# EAGLE design Grove PIR Sensor v1.2 (EAGLE 6.4)
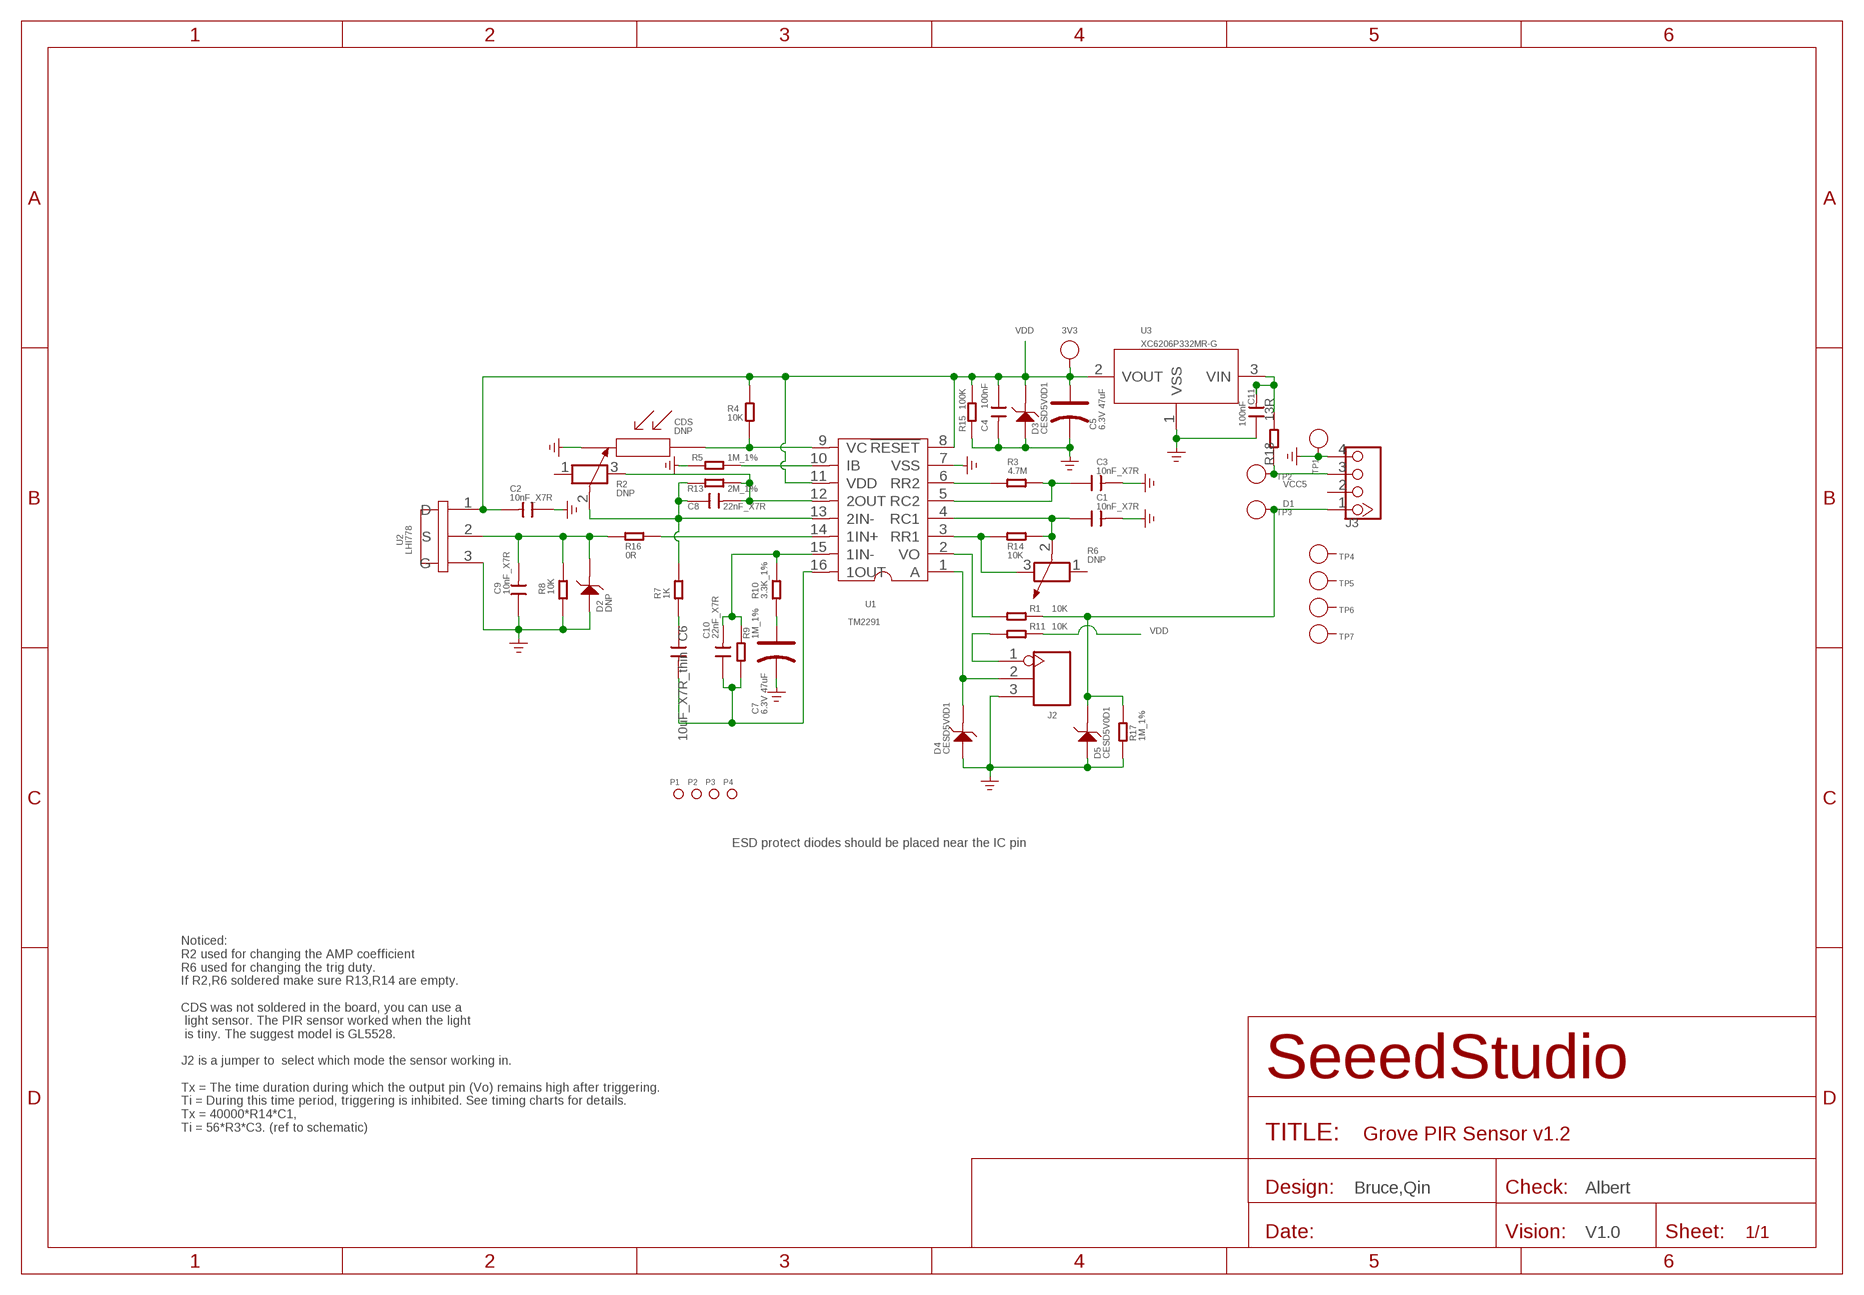
[diagram p0: schematic, sheet 1]

## Parts
3V3  PAD-TEST-POINT'3535'  [TP_3535]
C1  10nF_X7R  C-0603  [C0603]
C2  10nF_X7R  C-0603  [C0603]
C3  10nF_X7R  C-0603  [C0603]
C4  100nF  C-0603  [C0603]
C5  6.3V 47uF  CAP-AVX-A  [AVX-A]
C6  10uF_X7R_thin  C-0805  [C0805]
C7  6.3V 47uF  CAP-AVX-A  [AVX-A]
C8  22nF_X7R  C-0603  [C0603]
C9  10nF_X7R  C-0603  [C0603]
C10  22nF_X7R  C-0603  [C0603]
C11  100nF  C-0603  [C0603]
CDS  DNP  CDS  [CDS]
D2  DNP  D-ESD-2P'CESD5V0D1'  [SOD123-2.7X1.6]
D3  CESD5V0D1  D-ESD-2P'CESD5V0D1'  [SOD123-2.7X1.6]
D4  CESD5V0D1  D-ESD-2P'CESD5V0D1'  [SOD123-2.7X1.6]
D5  CESD5V0D1  D-ESD-2P'CESD5V0D1'  [SOD123-2.7X1.6]
J2  HEADER-3P-2.54  [3P-2.54]
J3  TWIG-4P-2.0-2.0  [4P-2.0]
P1  PAD-MARK  [ROUND-MARK-1.0]
P2  PAD-MARK  [ROUND-MARK-1.0]
P3  PAD-MARK  [ROUND-MARK-1.0]
P4  PAD-MARK  [ROUND-MARK-1.0]
R1  10K  R-0603  [R0603]
R2  DNP  R-POTENTIOMETER-SMD  [3P-SMD-SQUA-3.6X3.3]
R3  4.7M  R-0603  [R0603]
R4  10K  R-0603  [R0603]
R5  1M_1%  R-0603  [R0603]
R6  DNP  R-POTENTIOMETER-SMD  [3P-SMD-SQUA-3.6X3.3]
R7  1K  R-0603  [R0603]
R8  10K  R-0603  [R0603]
R9  1M_1%  R-0603  [R0603]
R10  3.3K_1%  R-0603  [R0603]
R11  10K  R-0603  [R0603]
R13  2M_1%  R-0603  [R0603]
R14  10K  R-0603  [R0603]
R15  100K  R-0603  [R0603]
R16  0R  R-0603  [R0603]
R17  1M_1%  R-0603  [R0603]
R18  13R  R-1206  [R1206]
TP1  PAD-TEST-POINT'3535'  [TP_3535]
TP2  PAD-TEST-POINT'3535'  [TP_3535]
TP3  PAD-TEST-POINT'3535'  [TP_3535]
TP4  PAD-TEST-POINT'3535'  [TP_3535]
TP5  PAD-TEST-POINT'3535'  [TP_3535]
TP6  PAD-TEST-POINT'3535'  [TP_3535]
TP7  PAD-TEST-POINT'3535'  [TP_3535]
U1  TM2291  [SOP16]
U2  LHI778  [3P-D8.1MM]
U3  XC6206P332MR-G  XC6206MR  [SOT23]

## Nets
D1: D5.2 J3.1 R1.1 R17.2 TP3.T
GND: C1.2 C2.1 C3.2 C4.2 C5.- C7.- C9.1 C11.1 CDS.1 D2.1 D3.1 D4.1 D5.1 J2.3 J3.4 R5.1 R8.1 R15.2 R17.1 TP1.T U1.7(VSS) U2.3(G) U3.1(VSS)
N$1: R6.3 R14.1 U1.3(RR1)
N$2: C1.1 R6.2 R14.2 U1.4(RC1)
N$4: J2.1 R11.2
N$5: R1.2 U1.2(VO)
N$6: R3.2 U1.6(RR2)
N$7: C3.1 R3.1 U1.5(RC2)
N$8: CDS.2 R4.2 U1.9(VC)
N$9: R5.2 U1.10(IB)
N$10: C9.2 D2.2 R8.2 R16.2 U2.2(S)
N$11: C8.2 R2.3 R13.1 U1.12(2OUT)
N$12: C8.1 R2.2 R7.2 R13.2 U1.13(2IN-)
N$13: C6.2 C10.1 R9.1 U1.16(1OUT)
N$14: C10.2 R9.2 R10.2 U1.15(1IN-)
N$15: C6.1 R7.1
N$16: D4.2 J2.2 U1.1(A)
N$17: C7.+ R10.1
N$19: R16.1 U1.14(1IN+)
N$20: C11.2 R18.2 U3.3(VIN)
VCC5: J3.3 R18.1 TP2.T
VDD: 3V3.T C2.2 C4.1 C5.+ D3.2 R4.1 R11.1 R15.1 U1.8(!RESET) U1.11(VDD) U2.1(D) U3.2(VOUT)
Unconnected: J3.2 R2.1 R6.1 TP4.T TP5.T TP6.T TP7.T

## Notes on the sheet
- ESD protect diodes should be placed near the IC pin
- Noticed:
  R2 used for changing the AMP coefficient
  R6 used for changing the trig duty.
  If R2,R6 soldered make sure R13,R14 are empty.
  
  CDS was not soldered in the board, you can use a
   light sensor. The PIR sensor worked when the light
   is tiny. The suggest model is GL5528.
  
  J2 is a jumper to  select which mode the sensor working in.
  
  Tx = The time duration during which the output pin (Vo) remains high after triggering.
  Ti = During this time period, triggering is inhibited. See timing charts for details.
  Tx = 40000*R14*C1,
  Ti = 56*R3*C3. (ref to schematic)
- Bruce,Qin | Albert
- V1.0

## Library data of the parts
3V3 TP1-TP7 = Discrete:PAD-TEST-POINT; PARTNO: DNP
C1-C4 C6 C8-C11 = Discrete:C*: Ceramic Capacitors
C5 C7 = Discrete:CAP*: Electrolytic Capacitors,Tantalum Capacitors and Super Capacitors
CDS = seeedleo:CDS
D2-D5 = Discrete:D-ESD-2P: Diodes for Protectiong against ESD
J2 = Connector:HEADER-3P
J3 = Connector :TWIG-4P-2.0
P1-P4 = Discrete:PAD-MARK; PARTNO: DNP
R1 R3-R5 R7-R11 R13-R18 = Discrete:R*
R2 R6 = Discrete:R-POTENTIOMETER*: Potentiometer
U1 = PIR_motion_sensor:TM2291: Infrared signal processor
U2 = PIR_motion_sensor:LHI778: Pyroelectric Infrared Detectors
U3 = IC:XC6206: LOW ESR Cap.Compatible Positive Voltage Regulators

## Board
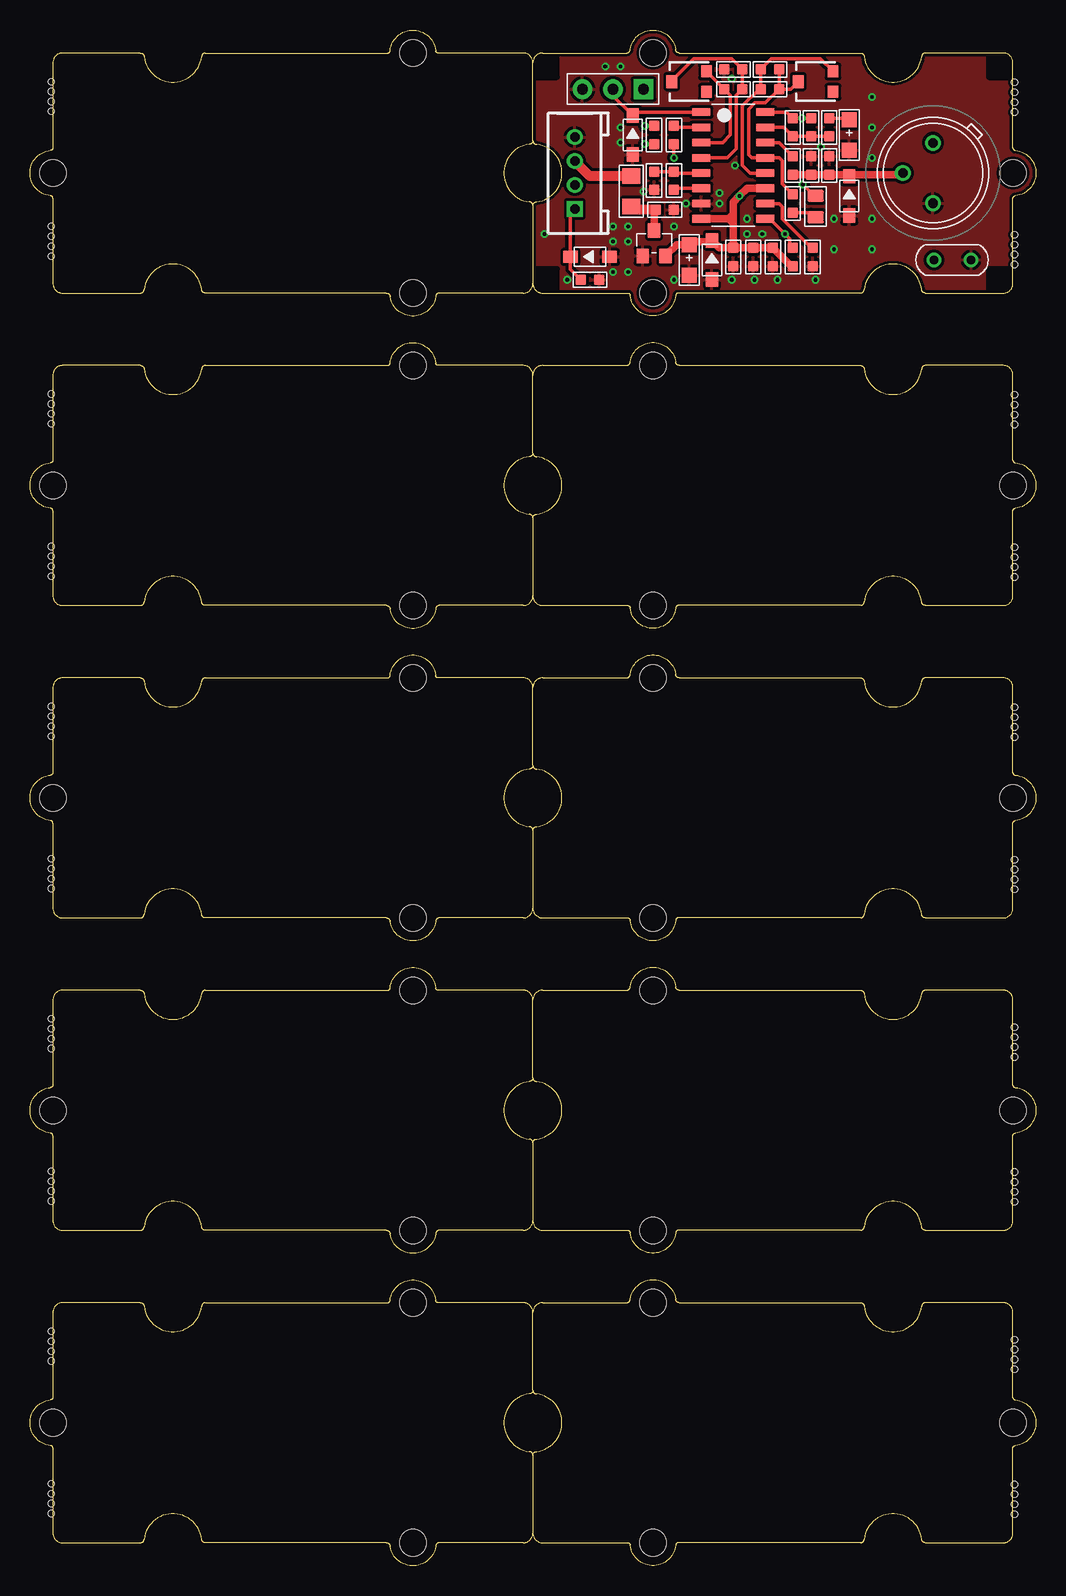
[diagram p1: board, top side]
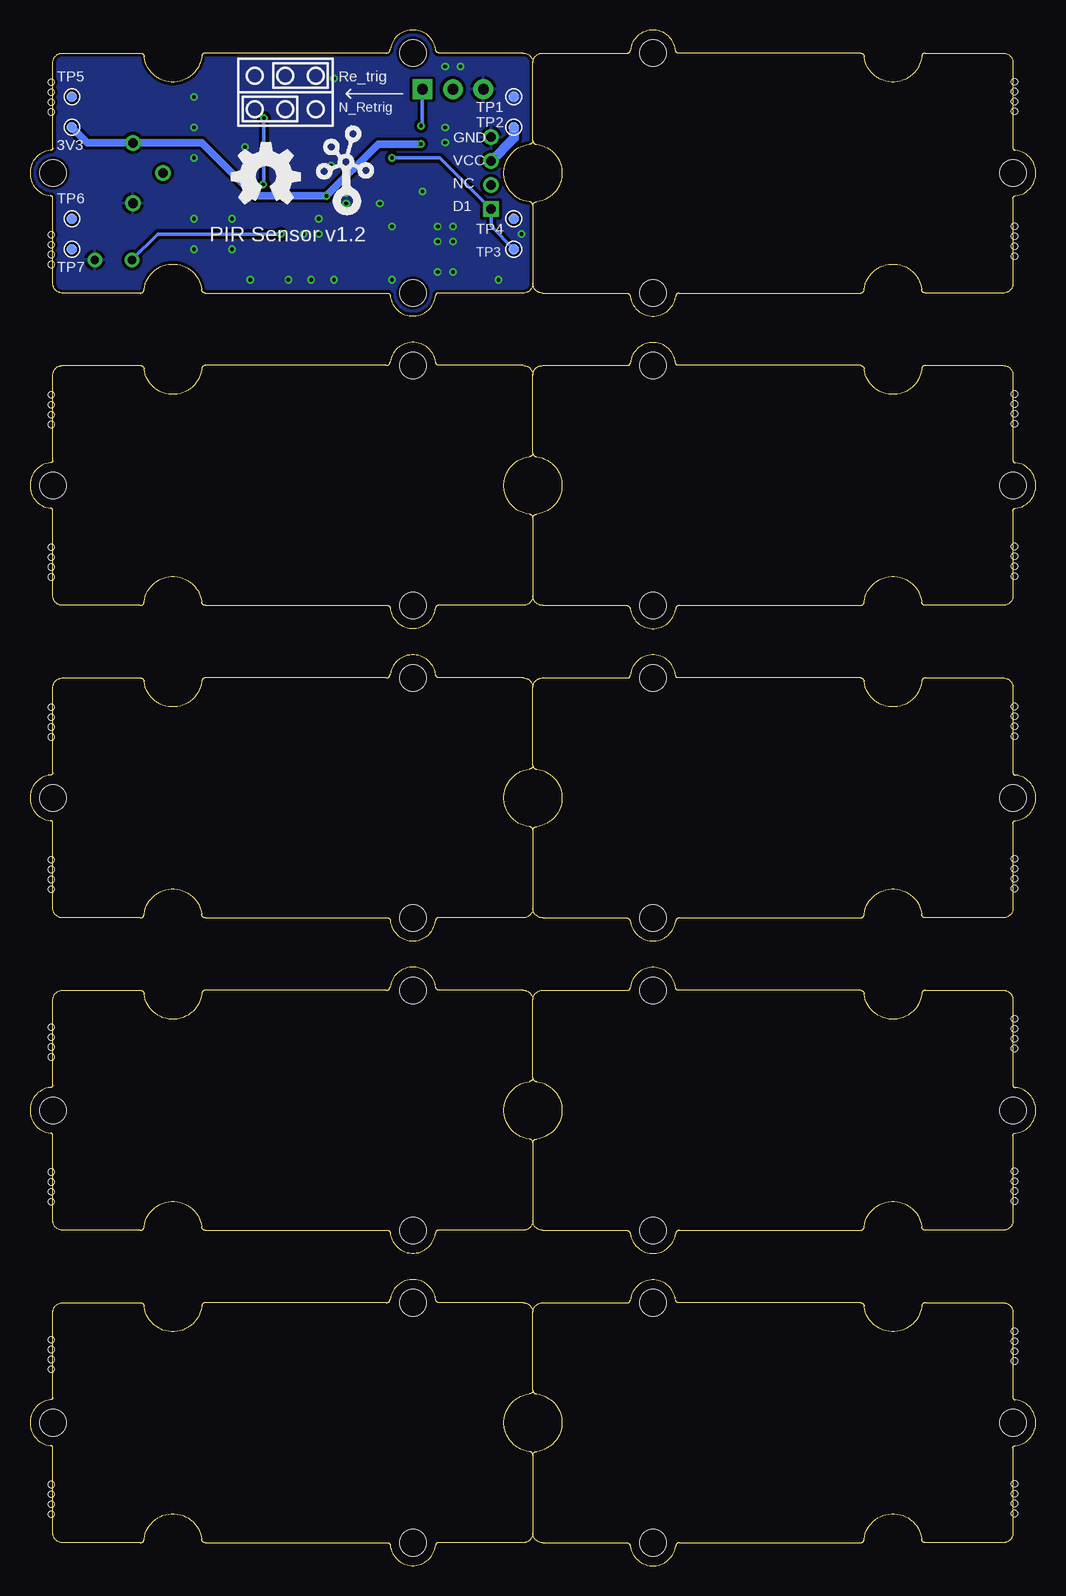
[diagram p2: board, bottom side, seen from below]

Size 83.82 x 127.98 mm. Coordinates in mm from the lower left corner, seen from the top.
Copper layers (1*16): Top 0.035mm / dielectric 1.5mm / Bottom 0.035mm
Design rules "default *": minimum track width 6mil, minimum drill 12mil, track to track 6mil, track to pad 6mil, pad to pad 6mil, via to via 6mil, smd to smd 0mil, copper to edge 10mil, drill to drill 10mil, minimum pad ring 10mil, minimum via ring 6mil, stop-mask expansion 2mil, vias tented up to drill 100mil, thermal gap 10mil
Holes 0.5 mm at 1.78,32.88 1.78,30.4 1.78,31.23 1.78,32.05 1.78,45.58 1.78,43.1 1.78,43.93 1.78,44.75 1.78,58.91 1.78,56.43 1.78,57.26 1.78,58.09 1.78,71.61 1.78,69.13 1.78,69.96 1.78,70.79 1.78,84.95 1.78,82.47 1.78,83.3 1.78,84.12 1.78,97.65 1.78,95.17 1.78,96 1.78,96.82 1.78,111.62 1.78,109.14 1.78,109.97 1.78,110.79 1.78,123.68 1.78,121.2 1.78,122.03 1.78,122.86 82.04,121.14 82.04,123.62 82.04,122.79 82.04,121.97 82.04,108.44 82.04,110.92 82.04,110.09 82.04,109.27 82.04,95.11 82.04,97.58 82.04,96.76 82.04,95.93 82.04,82.41 82.04,84.88 82.04,84.06 82.04,83.23 82.04,69.07 82.04,71.55 82.04,70.72 82.04,69.9 82.04,56.37 82.04,58.85 82.04,58.02 82.04,57.2 82.04,42.4 82.04,44.88 82.04,44.05 82.04,43.23 82.04,30.34 82.04,32.81 82.04,31.99 82.04,31.16 1.78,6.84 1.78,4.36 1.78,5.19 1.78,6.02 1.78,19.54 1.78,17.06 1.78,17.89 1.78,18.72 82.04,16.37 82.04,18.84 82.04,18.02 82.04,17.19 82.04,4.3 82.04,6.78 82.04,5.95 82.04,5.13
Holes 1.91 mm at -4.13,2.4 87.95,2.4 87.95,125.59 -4.13,125.59

### Footprints (pad centres in the part's own frame; a part is rotated, then mirrored left to right if it is on the bottom)
TP_3535 = smd 0.889 x 0.889: T 0,0
C0603 = smd 0.889 x 0.889: 1 -0.762,0; 2 0.762,0
AVX-A = smd 1.27 x 1.27: + -1.27,0; - 1.27,0
C0805 = smd 1.016 x 1.397: 1 -0.889,0; 2 0.889,0
CDS = drill 0.7: 1 0,0; 2 3.1,0
SOD123-2.7X1.6 = smd 1.2 x 1.02: 1 -1.635,0; 2 1.635,0
3P-2.54 = drill 0.889 pad 1.651 square: 1 0,2.54 | drill 0.889 pad 1.651: 2 0,0; 3 0,-2.54
4P-2.0 = drill 0.8 pad 1.27 square: 1 -3,0 | drill 0.8 pad 1.27: 2 -1,0; 3 1,0; 4 3,0
ROUND-MARK-1.0 = smd 1.016 x 1.016: P$1 0,0
R0603 = smd 0.889 x 0.889: 1 -0.762,0; 2 0.762,0
3P-SMD-SQUA-3.6X3.3 = smd 1 x 0.9: 1 -0.85,-1.45; 3 0.85,-1.45 | smd 1.1 x 0.9: 2 0,1.45
R1206 = smd 1.27 x 1.524: 1 -1.27,0; 2 1.27,0
SOP16 = smd 0.635 x 1.524: 1 0,0; 2 1.27,0; 3 2.54,0; 4 3.81,0; 5 5.08,0; 6 6.35,0; 7 7.62,0; 8 8.89,0; 9 8.89,5.334; 10 7.62,5.334; 11 6.35,5.334; 12 5.08,5.334; 13 3.81,5.334; 14 2.54,5.334; 15 1.27,5.334; 16 0,5.334
3P-D8.1MM = drill 0.8: 1 1.778,1.778; 2 -1.778,1.778; 3 -1.778,-1.778
SOT23 = smd 1.016 x 1.2: 1 -0.95,-1.06; 2 0.95,-1.06; 3 0,1.06
GROVE-2CONNECTOR = hole 2.2: -10,-10; -10,10; 20,0

### Placement (x,y rotation side)
3V3  80.33,119.87 0 bottom
C1  58.61,124.7 180 top
C2  61.91,109.08 90 top
C3  52.01,115.43 270 top
C4  58.61,109.08 270 top
C5  54.93,108.82 270 top
C6  65.47,113.27 90 top
C7  68.26,119.24 270 top
C8  61.66,123.05 180 top
C9  66.61,116.7 270 top
C10  63.56,119.87 270 top
C11  52.9,113.01 180 top
CDS  78.42,108.82 180 top
D2  68.26,114.16 90 top
D3  56.83,108.82 90 top
D4  50.23,119.24 90 top
D5  46.67,109.08 180 top
J2  48.58,123.05 270 top
J3  45.4,116.06 90 top
P1  -4.13,7.48 0 top  (outside the outline)
P2  87.95,7.48 0 top  (outside the outline)
P3  -4.13,120.51 0 top  (outside the outline)
P4  87.95,120.51 0 top  (outside the outline)
R1  53.66,119.24 90 top
R2  65.47,123.68 90 top
R3  53.66,115.43 270 top
R4  63.56,109.08 90 top
R5  65.22,109.08 90 top
R6  54.93,123.68 90 top
R7  63.56,113.52 90 top
R8  65.09,116.7 270 top
R9  65.09,119.87 270 top
R10  66.61,119.87 270 top
R11  52.01,119.24 90 top
R13  61.66,124.7 0 top
R14  58.61,123.05 0 top
R15  60.26,109.08 270 top
R16  63.56,116.7 270 top
R17  46.67,107.17 180 top
R18  50.1,114.54 270 top
TP1  43.5,122.41 0 bottom
TP2  43.5,119.87 0 bottom
TP3  43.5,109.71 0 bottom
TP4  43.5,112.25 0 bottom
TP5  80.33,122.41 0 bottom
TP6  80.33,112.25 0 bottom
TP7  80.33,109.71 0 bottom
U1  55.94,121.14 270 top
U2  75.25,116.06 45 top
U3  52.01,110.22 0 top
U$3  [GROVE-2CONNECTOR]  21.91,116.06 180 top
U$16  [OSHW_FILLX200_NOTEXT]  66.99,113.52 0 bottom
U$17  [GROVE-2CONNECTOR]  61.91,116.06 0 top
U$18  [GROVE-2CONNECTOR]  21.91,90.03 180 top
U$19  [GROVE-2CONNECTOR]  61.91,90.03 0 top
U$20  [GROVE-2CONNECTOR]  21.91,63.99 180 top
U$21  [GROVE-2CONNECTOR]  61.91,63.99 0 top
U$22  [GROVE-2CONNECTOR]  21.91,37.96 180 top
U$23  [GROVE-2CONNECTOR]  61.91,37.96 0 top
U$24  [GROVE-2CONNECTOR]  21.91,11.92 180 top
U$25  [GROVE-2CONNECTOR]  61.91,11.92 0 top
U$26  [TWIGLOGO]  57.47,113.52 0 bottom

### Tracks (layer width: path | path; a pad name or v marks a point on that pad's centre or on a via)
D1  (via drill 0.3 pad 0.64)
  Top 0.305: J3.1 45.04,112.7 D5.2 45.04,108.04 R17.2 | R1.1 v53.66,117.33
  Bottom 0.305: v53.66,117.33 49.67,117.33 J3.1 45.4,111.62 TP3.T
GND  (via drill 0.3 pad 0.64)
  other vias: 58.48,107.17 60.39,107.17 62.29,107.17 65.47,107.17 66.99,112.25 70.17,112.25 59.75,110.98 61.02,110.98 59.75,112.25 57.47,113.52 66.99,109.71 70.17,109.71 57.47,114.41 58.74,116.7 58.48,123.94 49.21,124.95 54.67,113.52 53.66,111.62 53.66,107.17 48.58,110.35 49.85,110.35 49.85,107.81 48.58,107.81 49.21,119.87 49.21,118.6 51.12,114.54 70.17,117.33 70.17,119.87 65.91,118.22 42.86,110.98 44.77,107.17 70.17,122.41 49.85,111.62 48.58,111.62 47.94,124.95
  pour Top (isolate 0.254): 41.59,104 84.14,104 84.14,128.13 41.59,128.13
  pour Bottom (isolate 0.254): 41.59,104 84.14,104 84.14,128.13 41.59,128.13
N$1
  Top 0.305: R6.3 | U1.3 57.72,118.6 58.36,119.24 58.36,122.54 R14.1 R6.3 | 56.24,124.53 R6.3
N$2
  Top 0.305: R6.2 53.48,123.76 55.31,125.59 58.48,125.59 C1.1 R14.2 58.87,122.54 58.87,118.09 58.1,117.33 U1.4
N$4  (via drill 0.3 pad 0.64)
  Top 0.305: R11.2 v51.25,120
  Bottom 0.305: J2.1 51.12,120.13 v51.25,120
N$5
  Top 0.305: U1.2 53.79,119.87 R1.2
N$6
  Top 0.305: U1.6 53.79,114.79 R3.2
N$7
  Top 0.305: U1.5 53.79,116.06 R3.1 C3.1
N$8  (via drill 0.3 pad 0.64)
  Top 0.305: U1.9 61.66,112.25 v62.93,110.98 63.31,110.6 63.31,110.09 R4.2
  Bottom 0.305: v62.93,110.98 73.16,110.98 CDS.2
N$9
  Top 0.305: U1.10 62.42,113.52 62.68,113.27 62.68,112.25 65.09,109.84 R5.2
N$10
  Top 0.61: R16.2 R8.2 C9.2 66.87,115.93 68.12,115.93 | 68.12,115.93 72.61,115.93 U2.2 | 68.12,115.93 D2.2
N$11
  Top 0.305: R2.3 65.86,125.59 61.79,125.59 R13.1 C8.2 60.77,123.05 59.37,121.65 59.37,116.7 60.01,116.06 U1.12
N$12
  Top 0.305: C8.1 R13.2 | C8.1 63.38,123.05 R2.2 | R7.2 62.68,115.17 62.68,117.08 62.42,117.33 U1.13 60.14,117.33 59.88,117.59 59.88,121.4 60.39,121.9 61.28,121.9 C8.1
N$13  (via drill 0.3 pad 0.64)
  Top 0.305: U1.16 63.06,121.14 C10.1 v64.33,120.63 R9.1 | C6.2 65.34,114.16 v64.39,115.11
  Bottom 0.305: v64.33,120.63 64.33,115.17 v64.39,115.11
N$14
  Top 0.305: U1.15 62.8,119.87 C10.2 R9.2 R10.2
N$15
  Top 0.305: R7.1 65.09,112.76 C6.1
N$16
  Top 0.305: J2.2 48.58,122.52 D4.2 50.5,121.14 U1.1
N$17
  Top 0.305: R10.1 68.52,120.63
  Top 0.61: 68.52,120.63 68.39,120.63 C7.+
N$19
  Top 0.305: U1.14 62.42,118.6 R16.1
N$20
  Top 0.61: U3.3 52.01,112.89 C11.2
  Top 0.813: C11.2 50.36,113.01 R18.2
VCC5
  Top 0.813: R18.1 46.66,115.81 J3.3
  Bottom 0.813: TP2.T 43.5,118.97 J3.3
VDD  (via drill 0.3 pad 0.64)
  Top 0.305: R11.1 v51.25,118.47 | 56.69,110.35 56.69,110.44
  Top 0.61: C4.1 R15.1 C2.2 63.44,108.31 R4.1 | C4.1 58.61,111.87 | 58.61,111.87 58.61,112.63 | U1.8 58.23,112.25 | U1.11 59.75,114.79 v59.12,114.16 58.61,113.65 58.61,112.63 | 58.23,112.25 58.61,112.63 | 58.23,112.25 58.61,111.87 | 56.69,110.35 55.18,110.35 C5.+ 53.89,110.09 U3.2 | C4.1 57.45,109.84 D3.2 56.82,110.44 56.69,110.44
  Bottom 0.61: 3V3.T 79.03,118.58 U2.1 69.51,118.58 65.09,114.16 v59.12,114.16 54.8,118.47 v51.25,118.47

### Text on the board
bPlace: Re_trig | N_Retrig | GND | VCC | NC | D1 | PIR Sensor v1.2